# Altium schematic sheet SYNCBOX.SchDoc
size A3; CompanyName: KDS; Organization: KDS; DocumentNumber: 0; Revision: V1I1; SheetNumber: 0; SheetTotal: 11; PageSetup: Record=PageOptions|CenterHorizontal=True|CenterVertical=True|PrintScale=1.07|XCorrection=1.00|YCorrection=1.00|PrintKind=1|BorderSize=5000000|LeftOffset=0|BottomOffset=0|Orientation=2|PaperLength=1000|PaperWidth=1000|Scale=100|PaperSource=7|PrintQuality=600|MediaType=1|DitherType=10|PaperKind=A3|PrintScaleMode=1; ProjectName: KDS C6A816x Module
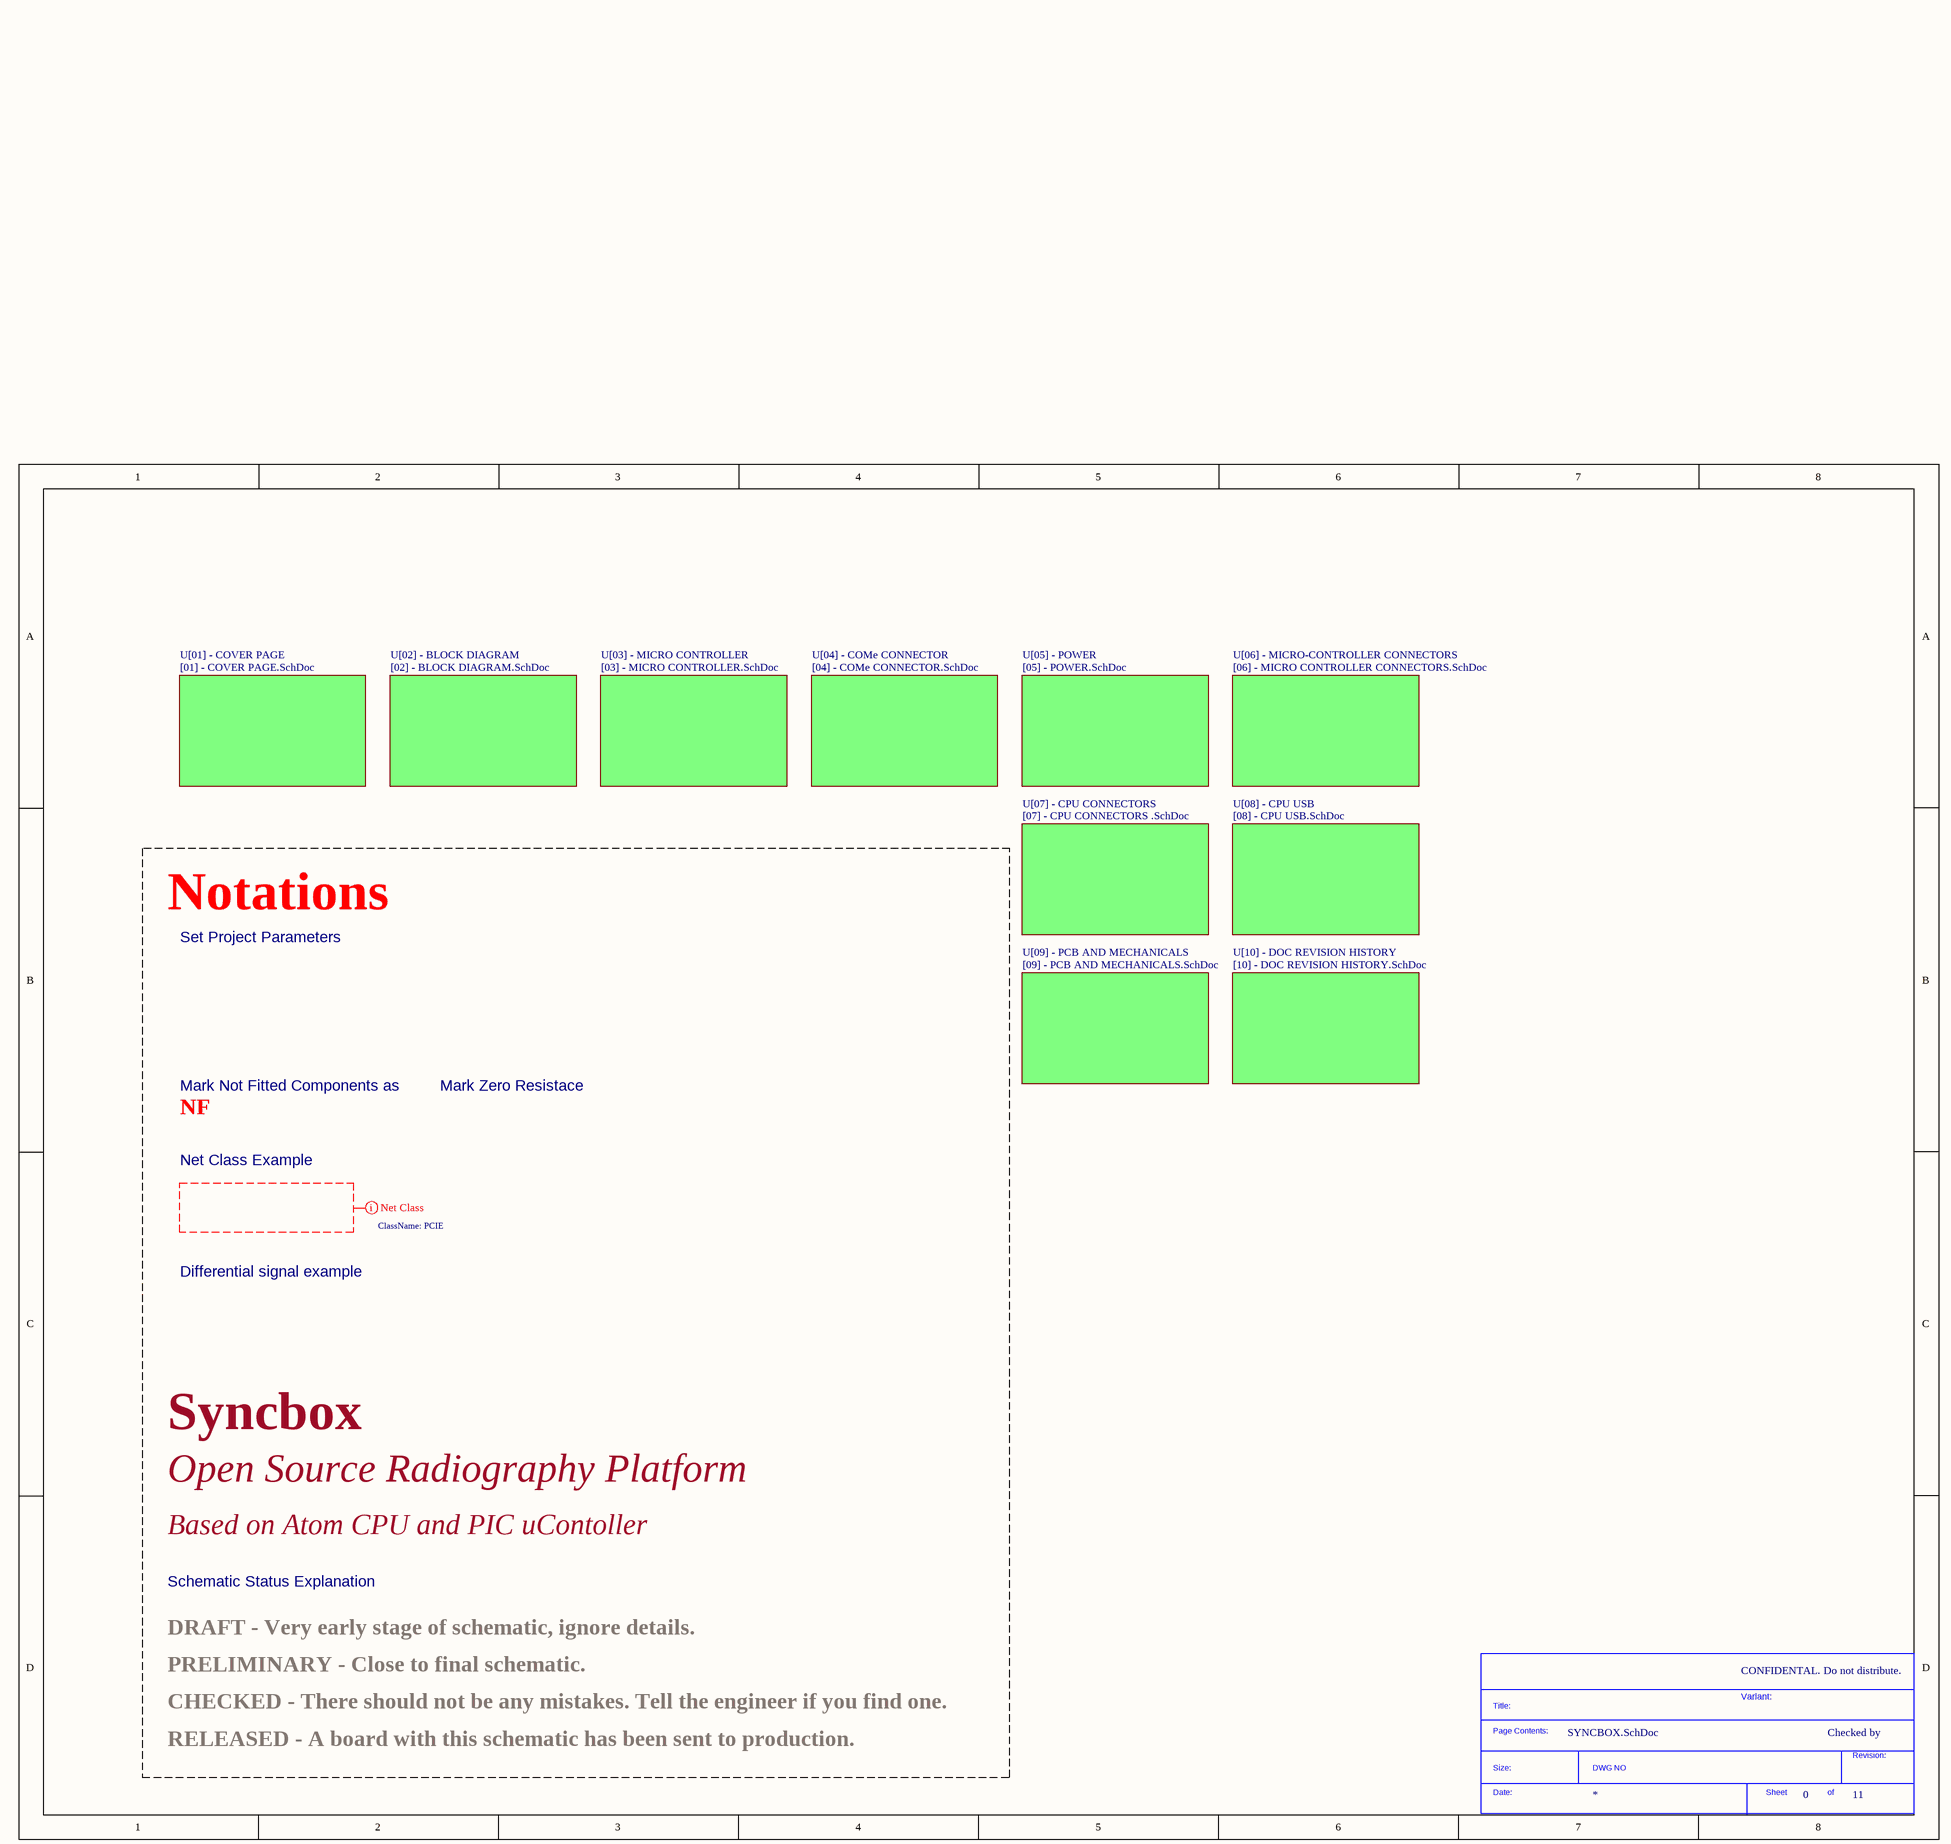
[diagram p0: SYNCBOX.SchDoc]

## Parts
*  SDTitleBlock  (value not drawn)  (graphical)

## Sub-sheets
U[01] - COVER PAGE = [01] - COVER PAGE.SchDoc: no entries
U[02] - BLOCK DIAGRAM = [02] - BLOCK DIAGRAM.SchDoc: no entries
U[03] - MICRO CONTROLLER = [03] - MICRO CONTROLLER.SchDoc: no entries
U[04] - COMe CONNECTOR = [04] - COMe CONNECTOR.SchDoc: no entries
U[05] - POWER = [05] - POWER.SchDoc: no entries
U[06] - MICRO-CONTROLLER CONNECTORS = [06] - MICRO CONTROLLER CONNECTORS.SchDoc: no entries
U[07] - CPU CONNECTORS = [07] - CPU CONNECTORS .SchDoc: no entries
U[08] - CPU USB = [08] - CPU USB.SchDoc: no entries
U[09] - PCB AND MECHANICALS = [09] - PCB AND MECHANICALS.SchDoc: no entries
U[10] - DOC REVISION HISTORY = [10] - DOC REVISION HISTORY.SchDoc: no entries

## Layout directives
net class PCIE: (no net found under the mark)

## Notes on the sheet
- Notations
- Set Project Parameters
- NF
- Mark Not Fitted Components as
- Mark Zero Resistace
- Net Class Example
- Differential signal example
- Syncbox
- Open Source Radiography Platform
- Based on Atom CPU and PIC uContoller
- Schematic Status Explanation
- PRELIMINARY - Close to final schematic.
- DRAFT - Very early stage of schematic, ignore details.
- CONFIDENTAL. Do not distribute.
- CHECKED - There should not be any mistakes. Tell the engineer if you find one.
- Variant:
- Checked by
- RELEASED - A board with this schematic has been sent to production.
- (in symbol SDTitleBlock) Title:; Page Contents:; Revision:; Size:; DWG NO; Date:; Sheet; of